# Altium project bms_mainboard-1_1.PrjPcb (part 6 of 8)

## Sheet eth_ksz8567r_switch.SchDoc
size C
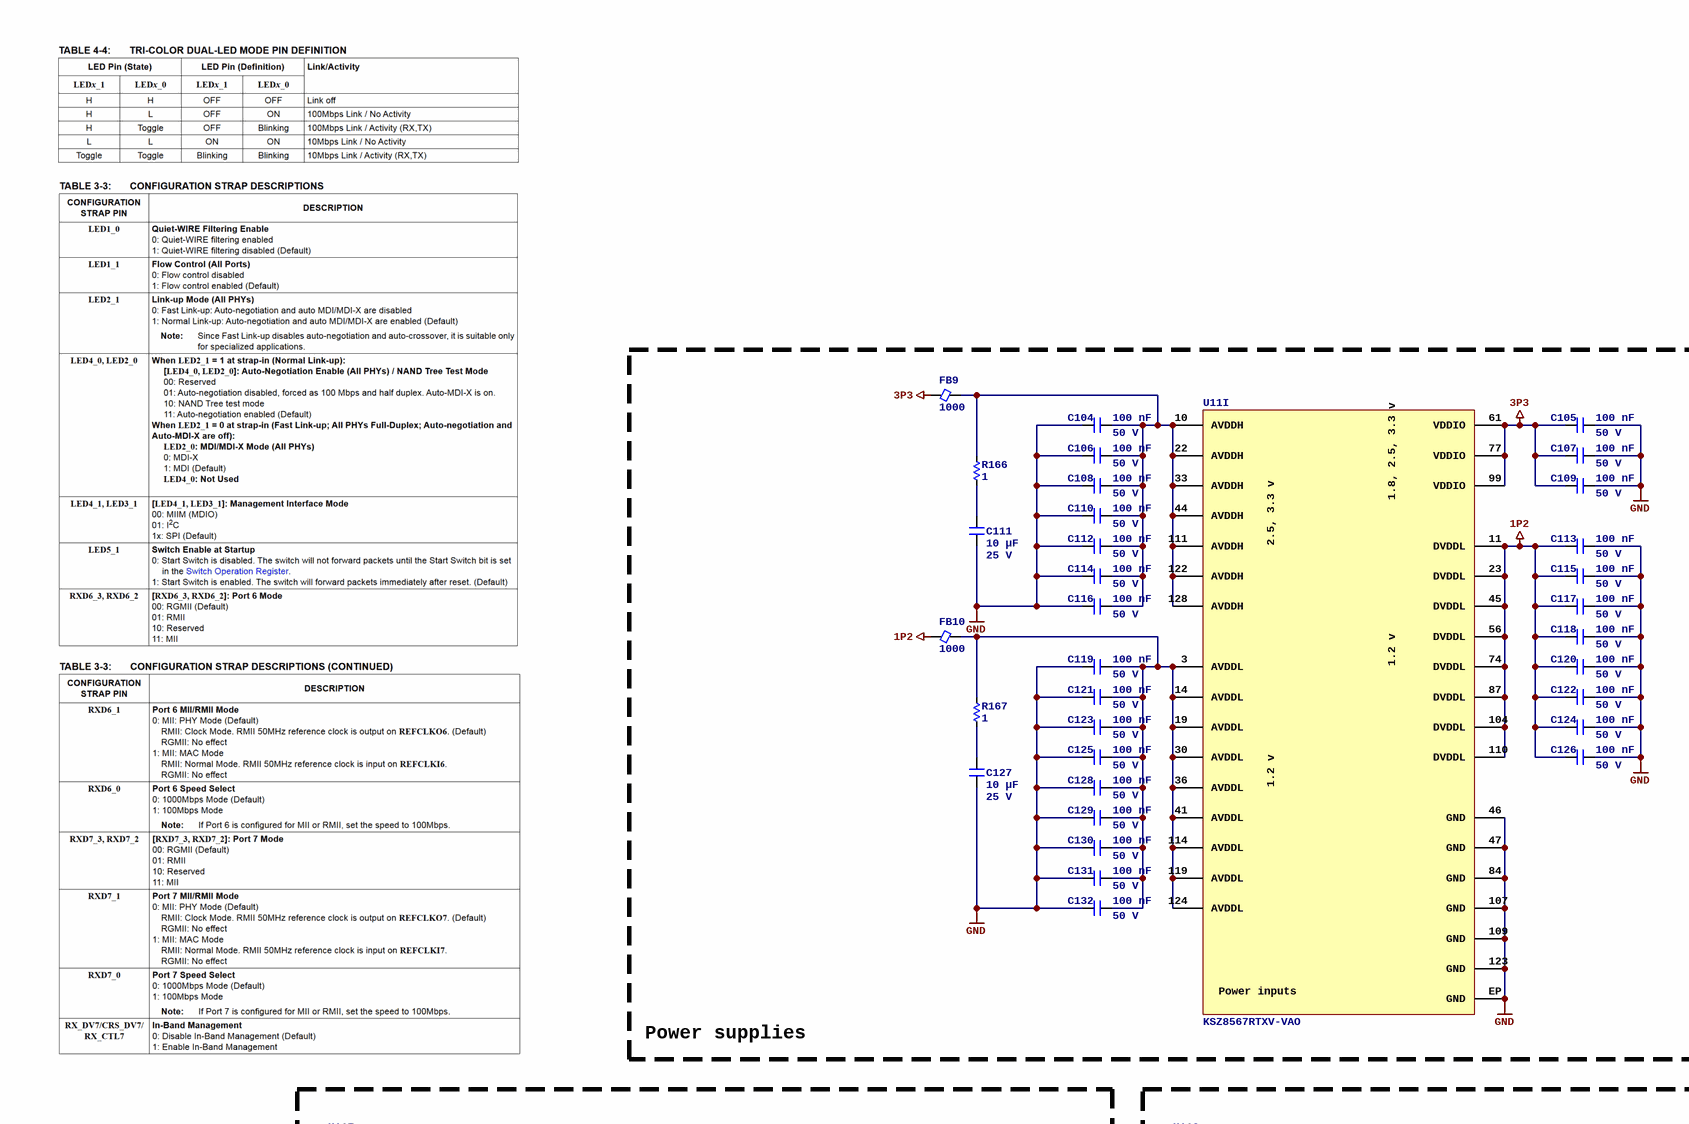
[diagram p31: eth_ksz8567r_switch.SchDoc, top left]
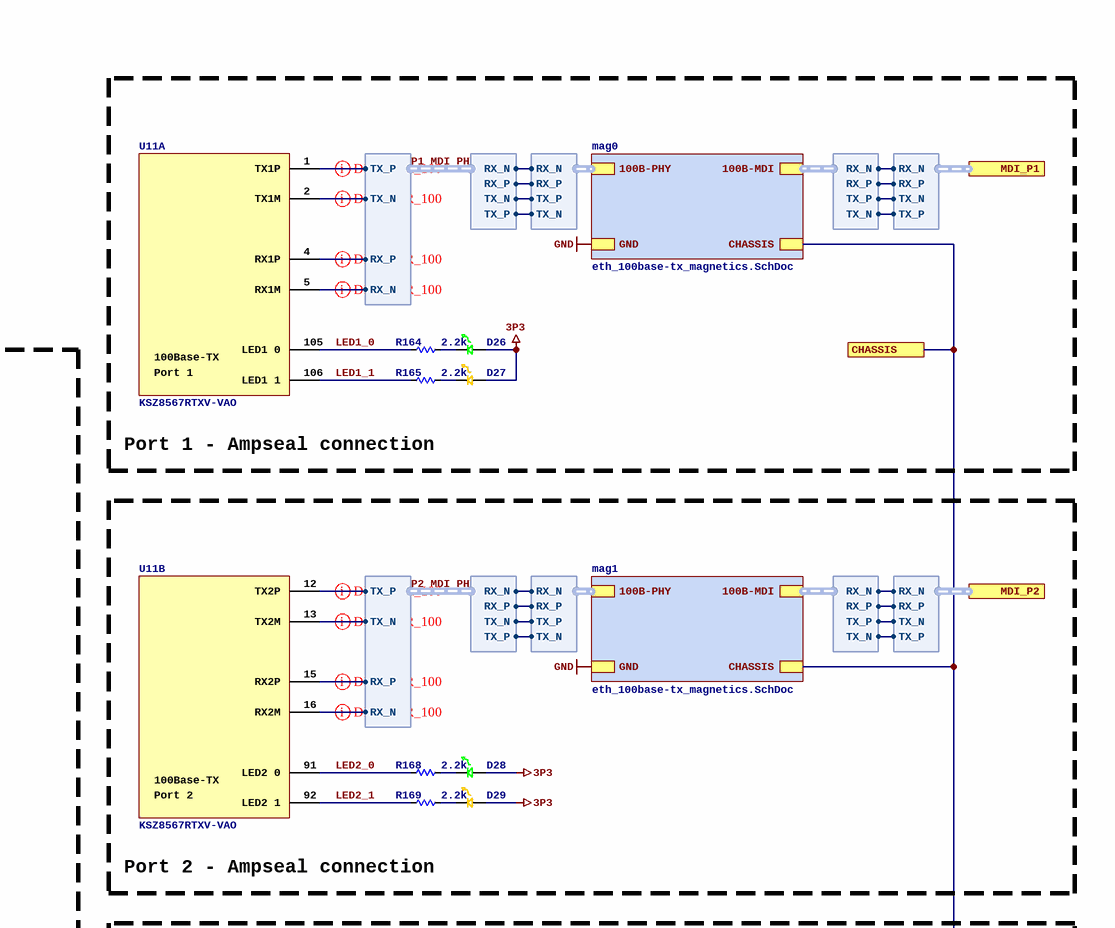
[diagram p32: eth_ksz8567r_switch.SchDoc, top right]
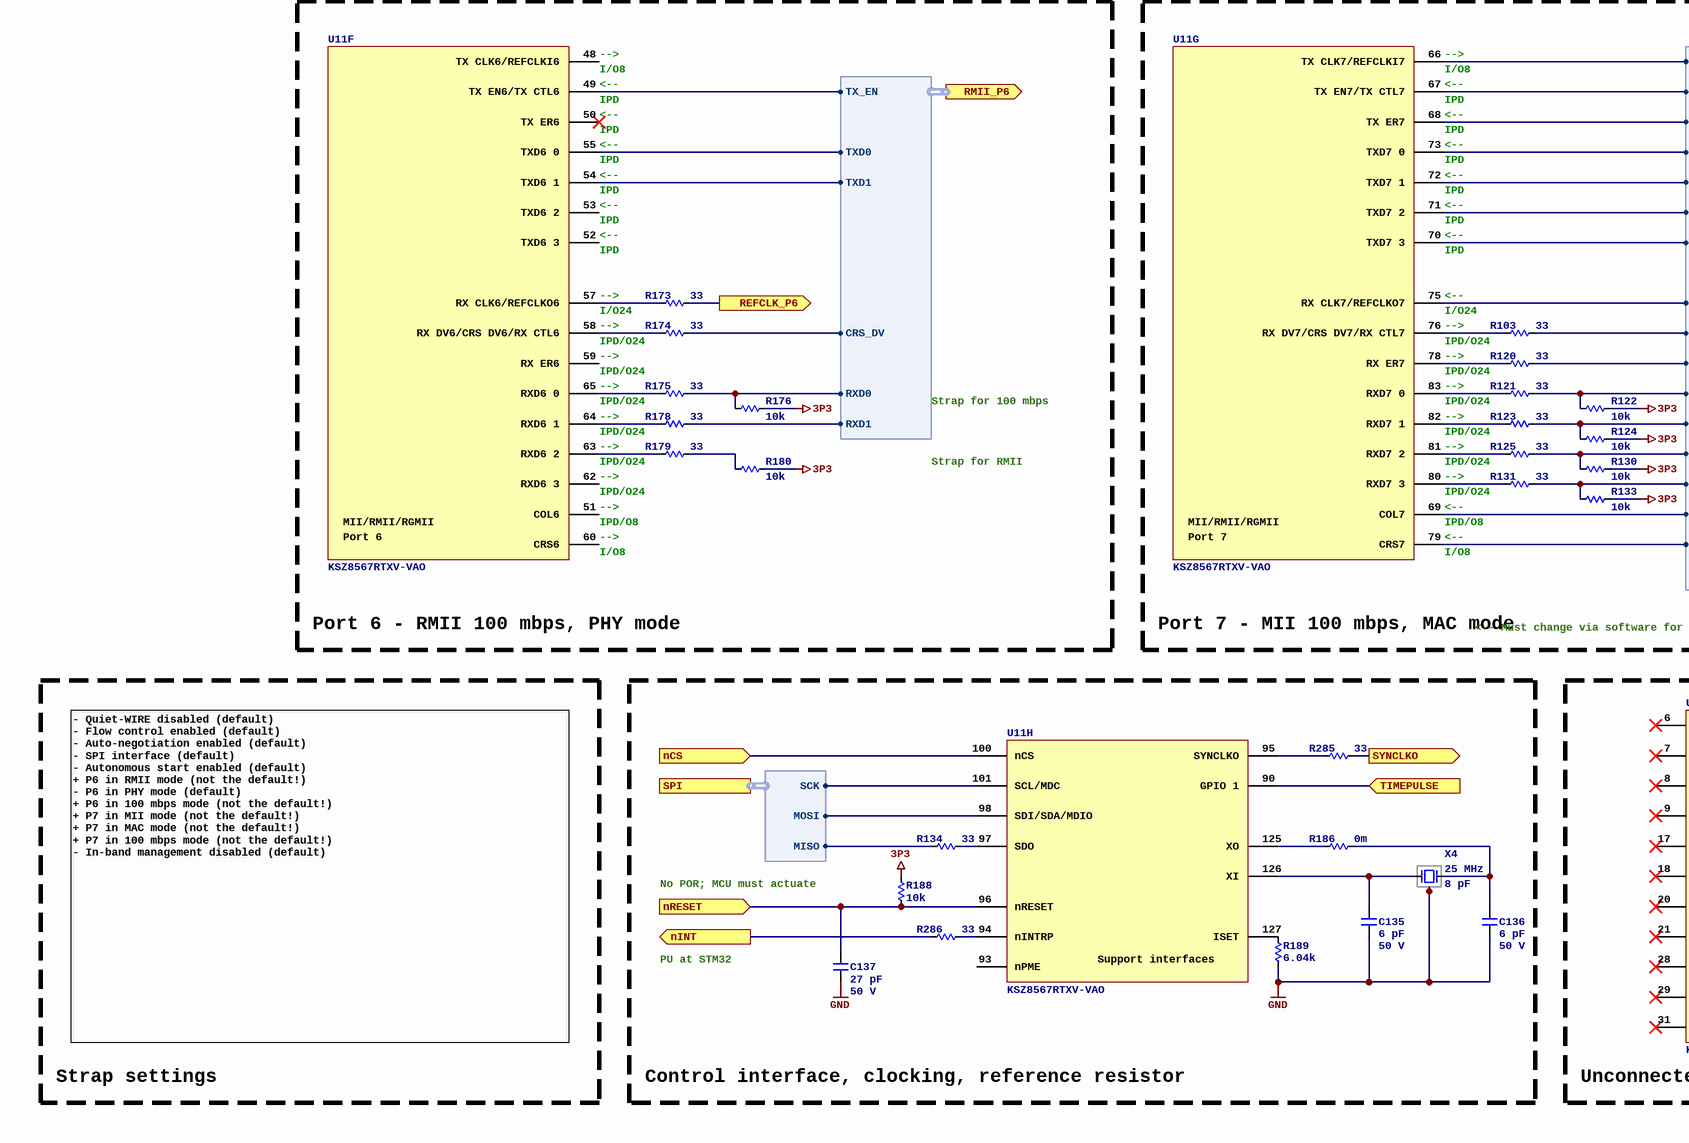
[diagram p33: eth_ksz8567r_switch.SchDoc, bottom left]
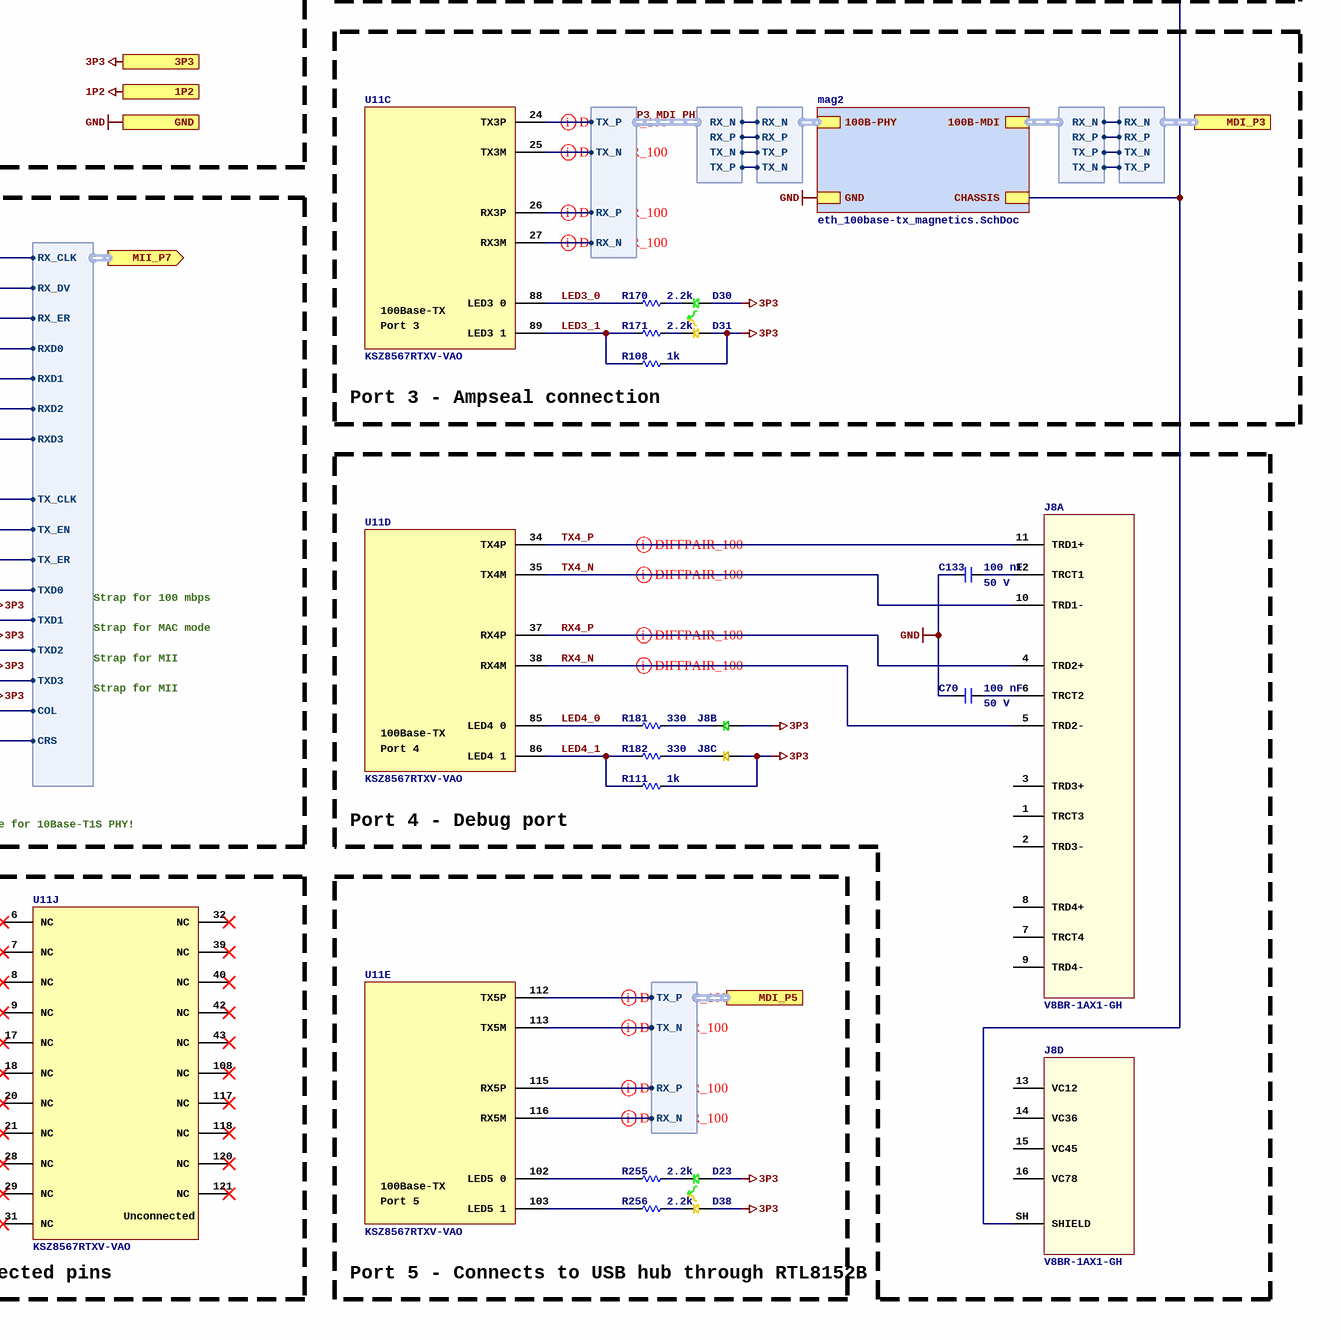
[diagram p34: eth_ksz8567r_switch.SchDoc, bottom right]

### Parts
C70  Capacitance: 100 nF  Voltage Rating: 50 V  [C0402]  (hidden comment: CL05B104KB54PNC)
C104  Capacitance: 100 nF  Voltage Rating: 50 V  [C0402]  (hidden comment: CL05B104KB54PNC)
C105  Capacitance: 100 nF  Voltage Rating: 50 V  [C0402]  (hidden comment: CL05B104KB54PNC)
C106  Capacitance: 100 nF  Voltage Rating: 50 V  [C0402]  (hidden comment: CL05B104KB54PNC)
C107  Capacitance: 100 nF  Voltage Rating: 50 V  [C0402]  (hidden comment: CL05B104KB54PNC)
C108  Capacitance: 100 nF  Voltage Rating: 50 V  [C0402]  (hidden comment: CL05B104KB54PNC)
C109  Capacitance: 100 nF  Voltage Rating: 50 V  [C0402]  (hidden comment: CL05B104KB54PNC)
C110  Capacitance: 100 nF  Voltage Rating: 50 V  [C0402]  (hidden comment: CL05B104KB54PNC)
C111  Capacitance: 10 µF  Voltage Rating: 25 V  [C0805]  (hidden comment: CL21B106KAYQNNE)
C112  Capacitance: 100 nF  Voltage Rating: 50 V  [C0402]  (hidden comment: CL05B104KB54PNC)
C113  Capacitance: 100 nF  Voltage Rating: 50 V  [C0402]  (hidden comment: CL05B104KB54PNC)
C114  Capacitance: 100 nF  Voltage Rating: 50 V  [C0402]  (hidden comment: CL05B104KB54PNC)
C115  Capacitance: 100 nF  Voltage Rating: 50 V  [C0402]  (hidden comment: CL05B104KB54PNC)
C116  Capacitance: 100 nF  Voltage Rating: 50 V  [C0402]  (hidden comment: CL05B104KB54PNC)
C117  Capacitance: 100 nF  Voltage Rating: 50 V  [C0402]  (hidden comment: CL05B104KB54PNC)
C118  Capacitance: 100 nF  Voltage Rating: 50 V  [C0402]  (hidden comment: CL05B104KB54PNC)
C119  Capacitance: 100 nF  Voltage Rating: 50 V  [C0402]  (hidden comment: CL05B104KB54PNC)
C120  Capacitance: 100 nF  Voltage Rating: 50 V  [C0402]  (hidden comment: CL05B104KB54PNC)
C121  Capacitance: 100 nF  Voltage Rating: 50 V  [C0402]  (hidden comment: CL05B104KB54PNC)
C122  Capacitance: 100 nF  Voltage Rating: 50 V  [C0402]  (hidden comment: CL05B104KB54PNC)
C123  Capacitance: 100 nF  Voltage Rating: 50 V  [C0402]  (hidden comment: CL05B104KB54PNC)
C124  Capacitance: 100 nF  Voltage Rating: 50 V  [C0402]  (hidden comment: CL05B104KB54PNC)
C125  Capacitance: 100 nF  Voltage Rating: 50 V  [C0402]  (hidden comment: CL05B104KB54PNC)
C126  Capacitance: 100 nF  Voltage Rating: 50 V  [C0402]  (hidden comment: CL05B104KB54PNC)
C127  Capacitance: 10 µF  Voltage Rating: 25 V  [C0805]  (hidden comment: CL21B106KAYQNNE)
C128  Capacitance: 100 nF  Voltage Rating: 50 V  [C0402]  (hidden comment: CL05B104KB54PNC)
C129  Capacitance: 100 nF  Voltage Rating: 50 V  [C0402]  (hidden comment: CL05B104KB54PNC)
C130  Capacitance: 100 nF  Voltage Rating: 50 V  [C0402]  (hidden comment: CL05B104KB54PNC)
C131  Capacitance: 100 nF  Voltage Rating: 50 V  [C0402]  (hidden comment: CL05B104KB54PNC)
C132  Capacitance: 100 nF  Voltage Rating: 50 V  [C0402]  (hidden comment: CL05B104KB54PNC)
C133  Capacitance: 100 nF  Voltage Rating: 50 V  [C0402]  (hidden comment: CL05B104KB54PNC)
C135  Capacitance: 6 pF  Voltage Rating: 50 V  [C0402]  (hidden comment: 0402CG6R0C500NT)
C136  Capacitance: 6 pF  Voltage Rating: 50 V  [C0402]  (hidden comment: 0402CG6R0C500NT)
C137  Capacitance: 27 pF  Voltage Rating: 50 V  [C0402]  (hidden comment: 0402CG270J500NT)
D23  LTST-C190GKT  [LED_0603P_GREEN]  (value not drawn)
D26  LTST-C190GKT  [LED_0603P_GREEN]  (value not drawn)
D27  LTST-C190AKT  [LED_0603P_AMBER]  (value not drawn)
D28  LTST-C190GKT  [LED_0603P_GREEN]  (value not drawn)
D29  LTST-C190AKT  [LED_0603P_AMBER]  (value not drawn)
D30  LTST-C190GKT  [LED_0603P_GREEN]  (value not drawn)
D31  LTST-C190AKT  [LED_0603P_AMBER]  (value not drawn)
D38  LTST-C190AKT  [LED_0603P_AMBER]  (value not drawn)
FB9  Current Rating (mA): 1000  [FB0805]  (hidden comment: MGGB2012M600HT-LF)
FB10  Current Rating (mA): 1000  [FB0805]  (hidden comment: MGGB2012M600HT-LF)
J8  V8BR-1AX1-GH  [BELFUSE_V8BR-1AX1-GH]  (parts A,B,C,D of 4)
R103  value 33  [R0402]  (hidden comment: 0402WGF330JTCE)
R108  value 1k  [R0402]  (hidden comment: 0402WGF1001TCE)
R111  value 1k  [R0402]  (hidden comment: 0402WGF1001TCE)
R120  value 33  [R0402]  (hidden comment: 0402WGF330JTCE)
R121  value 33  [R0402]  (hidden comment: 0402WGF330JTCE)
R122  value 10k  [R0402]  (hidden comment: 0402WGF1002TCE)
R123  value 33  [R0402]  (hidden comment: 0402WGF330JTCE)
R124  value 10k  [R0402]  (hidden comment: 0402WGF1002TCE)
R125  value 33  [R0402]  (hidden comment: 0402WGF330JTCE)
R130  value 10k  [R0402]  (hidden comment: 0402WGF1002TCE)
R131  value 33  [R0402]  (hidden comment: 0402WGF330JTCE)
R133  value 10k  [R0402]  (hidden comment: 0402WGF1002TCE)
R134  value 33  [R0402]  (hidden comment: 0402WGF330JTCE)
R164  value 2.2k  [R0402]  (hidden comment: 0402WGF2201TCE)
R165  value 2.2k  [R0402]  (hidden comment: 0402WGF2201TCE)
R166  value 1  [R0402]  (hidden comment: CRCW04021R00FKED)
R167  value 1  [R0402]  (hidden comment: CRCW04021R00FKED)
R168  value 2.2k  [R0402]  (hidden comment: 0402WGF2201TCE)
R169  value 2.2k  [R0402]  (hidden comment: 0402WGF2201TCE)
R170  value 2.2k  [R0402]  (hidden comment: 0402WGF2201TCE)
R171  value 2.2k  [R0402]  (hidden comment: 0402WGF2201TCE)
R173  value 33  [R0402]  (hidden comment: 0402WGF330JTCE)
R174  value 33  [R0402]  (hidden comment: 0402WGF330JTCE)
R175  value 33  [R0402]  (hidden comment: 0402WGF330JTCE)
R176  value 10k  [R0402]  (hidden comment: 0402WGF1002TCE)
R178  value 33  [R0402]  (hidden comment: 0402WGF330JTCE)
R179  value 33  [R0402]  (hidden comment: 0402WGF330JTCE)
R180  value 10k  [R0402]  (hidden comment: 0402WGF1002TCE)
R181  value 330  [R0402]  (hidden comment: 0402WGF3300TCE)
R182  value 330  [R0402]  (hidden comment: 0402WGF3300TCE)
R186  value 0m  [R0402]  (hidden comment: 0402WGF0000TCE)
R188  value 10k  [R0402]  (hidden comment: 0402WGF1002TCE)
R189  value 6.04k  [R0402]  (hidden comment: 0402WGF6041TCE)
R255  value 2.2k  [R0402]  (hidden comment: 0402WGF2201TCE)
R256  value 2.2k  [R0402]  (hidden comment: 0402WGF2201TCE)
R285  value 33  [R0402]  (hidden comment: 0402WGF330JTCE)
R286  value 33  [R0402]  (hidden comment: 0402WGF330JTCE)
U11  KSZ8567RTXV-VAO  [MICROCHIP_C04-418B_128TQFP_14X14_10X10EP]  (parts A,B,C,D,E,F,G,H,I,J of 10)
X4  Frequency: 25 MHz  Capacitance: 8 pF  [4_SMD_2.0X1.6MM]  (hidden comment: ABM11W-25.0000MHZ-8-D1X-T3)

### Blocks framed on the sheet
Port 1 - Ampseal connection: D26 D27 R164 R165 U11
Power supplies: C104-C132 FB9 FB10 R166 R167 U11
Port 2 - Ampseal connection: D28 D29 R168 R169 U11
Port 3 - Ampseal connection: D30 D31 R108 R170 R171 U11
Port 6 - RMII 100 mbps, PHY mode: R173-R176 R178-R180 U11
Port 7 - MII 100 mbps, MAC mode: R103 R120-R125 R130 R131 R133 U11
Port 4 - Debug port: C70 C133 J8 R111 R181 R182 U11
Control interface, clocking, reference resistor: C135-C137 R134 R186 R188 R189 R285 R286 U11 X4
Unconnected pins: U11
Port 5 - Connects to USB hub through RTL8152B: D23 D38 R255 R256 U11

### Sub-sheets
mag0 = eth_100base-tx_magnetics.SchDoc: 100B-PHY (harness 100BASE-TX), GND, CHASSIS, 100B-MDI (harness 100BASE-TX)
mag1 = eth_100base-tx_magnetics.SchDoc: 100B-PHY (harness 100BASE-TX), GND, CHASSIS, 100B-MDI (harness 100BASE-TX)
mag2 = eth_100base-tx_magnetics.SchDoc: 100B-PHY (harness 100BASE-TX), GND, CHASSIS, 100B-MDI (harness 100BASE-TX)

### Ports
1P2, 3P3, CHASSIS, GND, MDI_P1 (harness 100BASE-TX), MDI_P2 (harness 100BASE-TX), MDI_P3 (harness 100BASE-TX), MDI_P5 (harness 100BASE-TX), MII_P7 (out, harness MII), nCS (in), nINT (out), nRESET (in), REFCLK_P6 (out), RMII_P6 (out, harness RMII), SPI (harness SPI), SYNCLKO (out), TIMEPULSE (in)

### Harnesses
100BASE-TX: RX_N, RX_P, TX_N, TX_P
RMII: CRS_DV, RXD0, RXD1, TX_EN, TXD0, TXD1
MII: RXD0, RXD1, TX_EN, TXD0, TXD1, RXD2, RXD3, TXD2, TXD3, TX_ER, TX_CLK, CRS, COL, RX_ER, RX_DV, RX_CLK
SPI: MISO, MOSI, SCK
100BASE-TX: TX_N, RX_N, RX_P, TX_P
100BASE-TX: TX_P, RX_N, TX_N, RX_P
100BASE-TX: TX_N, RX_N, TX_P, RX_P
100BASE-TX: TX_N, TX_P, RX_N, RX_P
100BASE-TX: RX_N, RX_P, TX_P, TX_N

### Nets
1P2: C113.1 C115.1 C117.1 C118.1 C120.1 C122.1 C124.1 C126.1 FB10.1 U11.11(DVDDL) U11.23(DVDDL) U11.45(DVDDL) U11.56(DVDDL) U11.74(DVDDL) U11.87(DVDDL) U11.104(DVDDL) U11.110(DVDDL) ; port 1P2
3P3: C105.1 C107.1 C109.1 D23.1 D26.1 D27.1 D28.1 D29.1 D30.1 D31.1 D38.1 FB9.1 J8.18 J8.20 R108.1 R111.1 R122.1 R124.1 R130.1 R133.1 R176.1 R180.1 R188.1 U11.61(VDDIO) U11.77(VDDIO) U11.99(VDDIO) ; port 3P3
CHASSIS: J8.SH(SHIELD) ; port CHASSIS, sheet mag0/CHASSIS, sheet mag1/CHASSIS, sheet mag2/CHASSIS
GND: C70.2 C104.2 C105.2 C106.2 C107.2 C108.2 C109.2 C110.2 C111.2 C112.2 C113.2 C114.2 C115.2 C116.2 C117.2 C118.2 C119.2 C120.2 C121.2 C122.2 C123.2 C124.2 C125.2 C126.2 C127.2 C128.2 C129.2 C130.2 C131.2 C132.2 C133.2 C135.2 C136.2 C137.2 R189.2 U11.46(GND) U11.47(GND) U11.84(GND) U11.107(GND) U11.109(GND) U11.123(GND) U11.EP(GND) X4.2 X4.4 ; port GND, sheet mag0/GND, sheet mag1/GND, sheet mag2/GND
ETH_P1.RX_N: port MDI_P1.RX_N, sheet mag0/100B-MDI.RX_N
ETH_P1.RX_P: port MDI_P1.RX_P, sheet mag0/100B-MDI.RX_P
ETH_P1.TX_N: port MDI_P1.TX_N, sheet mag0/100B-MDI.TX_P
ETH_P1.TX_P: port MDI_P1.TX_P, sheet mag0/100B-MDI.TX_N
ETH_P2.RX_N: port MDI_P2.RX_N, sheet mag1/100B-MDI.RX_N
ETH_P2.RX_P: port MDI_P2.RX_P, sheet mag1/100B-MDI.RX_P
ETH_P2.TX_N: port MDI_P2.TX_N, sheet mag1/100B-MDI.TX_P
ETH_P2.TX_P: port MDI_P2.TX_P, sheet mag1/100B-MDI.TX_N
ETH_P3.RX_N: port MDI_P3.RX_N, sheet mag2/100B-MDI.RX_N
ETH_P3.RX_P: port MDI_P3.RX_P, sheet mag2/100B-MDI.RX_P
ETH_P3.TX_N: port MDI_P3.TX_N, sheet mag2/100B-MDI.TX_P
ETH_P3.TX_P: port MDI_P3.TX_P, sheet mag2/100B-MDI.TX_N
ETH_P5.RX_N: U11.116(RX5M) ; port MDI_P5.RX_N
ETH_P5.RX_P: U11.115(RX5P) ; port MDI_P5.RX_P
ETH_P5.TX_N: U11.113(TX5M) ; port MDI_P5.TX_N
ETH_P5.TX_P: U11.112(TX5P) ; port MDI_P5.TX_P
ETH_REFCLK: R173.1 ; port REFCLK_P6
ETH_SWITCH_nINT: R286.2 ; port nINT
ETH_SWITCH_nRST: C137.1 R188.2 U11.96(nRESET) ; port nRESET
ETH_SWITCH_nSS3: U11.100(nCS) ; port nCS
ETH_SWITCH_SYNCLKO: R285.1 ; port SYNCLKO
LED1_0: R164.2 U11.105(LED1_0)
LED1_1: R165.2 U11.106(LED1_1)
LED2_0: R168.2 U11.91(LED2_0)
LED2_1: R169.2 U11.92(LED2_1)
LED3_0: R170.2 U11.88(LED3_0)
LED3_1: R108.2 R171.2 U11.89(LED3_1)
LED4_0: R181.1 U11.85(LED4_0)
LED4_1: R111.2 R182.1 U11.86(LED4_1)
MCU_RMII.CRS_DV: R174.1 ; port RMII_P6.CRS_DV
MCU_RMII.RXD0: R175.1 R176.2 ; port RMII_P6.RXD0
MCU_RMII.RXD1: R178.1 ; port RMII_P6.RXD1
MCU_RMII.TX_EN: U11.49(TX_EN6/TX_CTL6) ; port RMII_P6.TX_EN
MCU_RMII.TXD0: U11.55(TXD6_0) ; port RMII_P6.TXD0
MCU_RMII.TXD1: U11.54(TXD6_1) ; port RMII_P6.TXD1
MII_P7.COL: U11.69(COL7) ; port MII_P7.COL
MII_P7.CRS: U11.79(CRS7) ; port MII_P7.CRS
MII_P7.RX_CLK: U11.66(TX_CLK7/REFCLKI7) ; port MII_P7.RX_CLK
MII_P7.RX_DV: U11.67(TX_EN7/TX_CTL7) ; port MII_P7.RX_DV
MII_P7.RX_ER: U11.68(TX_ER7) ; port MII_P7.RX_ER
MII_P7.RXD0: U11.73(TXD7_0) ; port MII_P7.RXD0
MII_P7.RXD1: U11.72(TXD7_1) ; port MII_P7.RXD1
MII_P7.RXD2: U11.71(TXD7_2) ; port MII_P7.RXD2
MII_P7.RXD3: U11.70(TXD7_3) ; port MII_P7.RXD3
MII_P7.TX_CLK: U11.75(RX_CLK7/REFCLKO7) ; port MII_P7.TX_CLK
MII_P7.TX_EN: R103.1 ; port MII_P7.TX_EN
MII_P7.TX_ER: R120.1 ; port MII_P7.TX_ER
MII_P7.TXD0: R121.1 R122.2 ; port MII_P7.TXD0
MII_P7.TXD1: R123.1 R124.2 ; port MII_P7.TXD1
MII_P7.TXD2: R125.1 R130.2 ; port MII_P7.TXD2
MII_P7.TXD3: R131.1 R133.2 ; port MII_P7.TXD3
P1_MDI_PHY.RX_N: U11.5(RX1M) ; harness 100BASE-TX.RX_N, sheet mag0/100B-PHY.RX_N
P1_MDI_PHY.RX_P: U11.4(RX1P) ; harness 100BASE-TX.RX_P, sheet mag0/100B-PHY.RX_P
P1_MDI_PHY.TX_N: U11.2(TX1M) ; harness 100BASE-TX.TX_N, sheet mag0/100B-PHY.TX_P
P1_MDI_PHY.TX_P: U11.1(TX1P) ; harness 100BASE-TX.TX_P, sheet mag0/100B-PHY.TX_N
P2_MDI_PHY.RX_N: U11.16(RX2M) ; harness 100BASE-TX.RX_N, sheet mag1/100B-PHY.RX_N
P2_MDI_PHY.RX_P: U11.15(RX2P) ; harness 100BASE-TX.RX_P, sheet mag1/100B-PHY.RX_P
P2_MDI_PHY.TX_N: U11.13(TX2M) ; harness 100BASE-TX.TX_N, sheet mag1/100B-PHY.TX_P
P2_MDI_PHY.TX_P: U11.12(TX2P) ; harness 100BASE-TX.TX_P, sheet mag1/100B-PHY.TX_N
P3_MDI_PHY.RX_N: U11.27(RX3M) ; harness 100BASE-TX.RX_N, sheet mag2/100B-PHY.RX_N
P3_MDI_PHY.RX_P: U11.26(RX3P) ; harness 100BASE-TX.RX_P, sheet mag2/100B-PHY.RX_P
P3_MDI_PHY.TX_N: U11.25(TX3M) ; harness 100BASE-TX.TX_N, sheet mag2/100B-PHY.TX_P
P3_MDI_PHY.TX_P: U11.24(TX3P) ; harness 100BASE-TX.TX_P, sheet mag2/100B-PHY.TX_N
RX4_N: J8.5(TRD2-) U11.38(RX4M)
RX4_P: J8.4(TRD2+) U11.37(RX4P)
SPI2.MISO: R134.2 ; port SPI.MISO
SPI2.MOSI: U11.98(SDI/SDA/MDIO) ; port SPI.MOSI
SPI2.SCK: U11.101(SCL/MDC) ; port SPI.SCK
TIMEPULSE: U11.90(GPIO_1) ; port TIMEPULSE
TX4_N: J8.10(TRD1-) U11.35(TX4M)
TX4_P: J8.11(TRD1+) U11.34(TX4P)
NetC70_1: C70.1 J8.6(TRCT2)
NetC104_1: C104.1 C106.1 C108.1 C110.1 C112.1 C114.1 C116.1 FB9.2 R166.2 U11.10(AVDDH) U11.22(AVDDH) U11.33(AVDDH) U11.44(AVDDH) U11.111(AVDDH) U11.122(AVDDH) U11.128(AVDDH)
NetC111_1: C111.1 R166.1
NetC119_1: C119.1 C121.1 C123.1 C125.1 C128.1 C129.1 C130.1 C131.1 C132.1 FB10.2 R167.2 U11.3(AVDDL) U11.14(AVDDL) U11.19(AVDDL) U11.30(AVDDL) U11.36(AVDDL) U11.41(AVDDL) U11.114(AVDDL) U11.119(AVDDL) U11.124(AVDDL)
NetC127_1: C127.1 R167.1
NetC133_1: C133.1 J8.12(TRCT1)
NetC135_1: C135.1 U11.126(XI) X4.1
NetC136_1: C136.1 R186.2 X4.3
NetD23_2: D23.2 R255.1
NetD26_2: D26.2 R164.1
NetD27_2: D27.2 R165.1
NetD28_2: D28.2 R168.1
NetD29_2: D29.2 R169.1
NetD30_2: D30.2 R170.1
NetD31_2: D31.2 R171.1
NetD38_2: D38.2 R256.1
NetJ8_17: J8.17 R182.2
NetJ8_19: J8.19 R181.2
NetR103_2: R103.2 U11.76(RX_DV7/CRS_DV7/RX_CTL7)
NetR120_2: R120.2 U11.78(RX_ER7)
NetR121_2: R121.2 U11.83(RXD7_0)
NetR123_2: R123.2 U11.82(RXD7_1)
NetR125_2: R125.2 U11.81(RXD7_2)
NetR131_2: R131.2 U11.80(RXD7_3)
NetR134_1: R134.1 U11.97(SDO)
NetR173_2: R173.2 U11.57(RX_CLK6/REFCLKO6)
NetR174_2: R174.2 U11.58(RX_DV6/CRS_DV6/RX_CTL6)
NetR175_2: R175.2 U11.65(RXD6_0)
NetR178_2: R178.2 U11.64(RXD6_1)
NetR179_1: R179.1 R180.2
NetR179_2: R179.2 U11.63(RXD6_2)
NetR186_1: R186.1 U11.125(XO)
NetR189_1: R189.1 U11.127(ISET)
NetR255_2: R255.2 U11.102(LED5_0)
NetR256_2: R256.2 U11.103(LED5_1)
NetR285_2: R285.2 U11.95(SYNCLKO)
NetR286_1: R286.1 U11.94(nINTRP)

Not connected (* = marked no-connect by the designer): J8 1(TRCT3) 2(TRD3-) 3(TRD3+) 7(TRCT4) 8(TRD4+) 9(TRD4-) 13(VC12) 14(VC36) 15(VC45) 16(VC78); U11 6(NC)* 7(NC)* 8(NC)* 9(NC)* 17(NC)* 18(NC)* 20(NC)* 21(NC)* 28(NC)* 29(NC)* 31(NC)* 32(NC)* 39(NC)* 40(NC)* 42(NC)* 43(NC)* 48(TX_CLK6/REFCLKI6) 50(TX_ER6)* 51(COL6) 52(TXD6_3) 53(TXD6_2) 59(RX_ER6) 60(CRS6) 62(RXD6_3) 93(nPME) 108(NC)* 117(NC)* 118(NC)* 120(NC)* 121(NC)*

### Layout directives
differential pair; differential pair class DE_100: ETH_P5.RX_N, ETH_P5.RX_P, ETH_P5.TX_N, ETH_P5.TX_P, P1_MDI_PHY.RX_N, P1_MDI_PHY.RX_P, P1_MDI_PHY.TX_N, P1_MDI_PHY.TX_P, P2_MDI_PHY.RX_N, P2_MDI_PHY.RX_P, P2_MDI_PHY.TX_N, P2_MDI_PHY.TX_P, P3_MDI_PHY.RX_N, P3_MDI_PHY.RX_P, P3_MDI_PHY.TX_N, P3_MDI_PHY.TX_P, RX4_N, RX4_P, TX4_N, TX4_P

### Notes on the sheet
- (near U11) -->
- (near U11) I/O8
- (near U11) <--
- (near U11) IPD
- I/O24
- IPD/O24
- Strap for 100 mbps
- Strap for MAC mode
- (near U11) IPD/O8
- Strap for RMII
- IPD/O8
- Strap for MII
- <-- Must change via software for 10Base-T1S PHY!
- No POR; MCU must actuate
- PU at STM32
- - Quiet-WIRE disabled (default)
  - Flow control enabled (default)
  - Auto-negotiation enabled (default)
  - SPI interface (default)
  - Autonomous start enabled (default)
  + P6 in RMII mode (not the default!)
  - P6 in PHY mode (default)
  + P6 in 100 mbps mode (not the default!)
  + P7 in MII mode (not the default!)
  + P7 in MAC mode (not the default!)
  + P7 in 100 mbps mode (not the default!)
  - In-band management disabled (default)
- Strap settings
- (in symbol KSZ8567RTXV-VAO, part A) 100Base-TX; Port 1
- (in symbol KSZ8567RTXV-VAO, part B) 100Base-TX; Port 2
- (in symbol KSZ8567RTXV-VAO, part C) 100Base-TX; Port 3
- (in symbol KSZ8567RTXV-VAO, part D) 100Base-TX; Port 4
- (in symbol KSZ8567RTXV-VAO, part E) 100Base-TX; Port 5
- (in symbol KSZ8567RTXV-VAO, part F) MII/RMII/RGMII; Port 6
- (in symbol KSZ8567RTXV-VAO, part G) MII/RMII/RGMII; Port 7
- (in symbol KSZ8567RTXV-VAO, part H) Support interfaces
- (in symbol KSZ8567RTXV-VAO, part I) 1.8, 2.5, 3.3 v; 2.5, 3.3 v; 1.2 v; Power inputs
- (in symbol KSZ8567RTXV-VAO, part J) Unconnected

### Library data of the parts
C70 C104-C110 C112-C126 C128-C133 = CL05B104KB54PNC: Manufacturer: Samsung Electro-Mechanics; Dielectric: X7R; ComponentLink1URL: https://wmsc.lcsc.com/wmsc/upload/file/pdf/v2/lcsc/2304140030_Samsung-Electro-Mechanics-CL05B104KB54PNC_C307331.pdf; ComponentLink1Description: Datasheet; Manufacturer Part Number: CL05B104KB54PNC; Package: 0402; Supplier 2: LCSC; Supplier Part Number 2: C307331
C111 C127 = CL21B106KAYQNNE: Manufacturer: Samsung Electro-Mechanics; Dielectric: X7R; ComponentLink1URL: https://datasheet.lcsc.com/lcsc/2206222030_Samsung-Electro-Mechanics-CL21B106KAYQNNE_C3039694.pdf; ComponentLink1Description: Datasheet; Manufacturer Part Number: CL21B106KAYQNNE; Package: 0805; Supplier 2: LCSC; Supplier Part Number 2: C3039694
C135 C136 = 0402CG6R0C500NT: Manufacturer: FH(Guangdong Fenghua Advanced Tech); Dielectric: C0G; ComponentLink1URL: https://wmsc.lcsc.com/wmsc/upload/file/pdf/v2/lcsc/2304140030_FH--Guangdong-Fenghua-Advanced-Tech-0402CG6R0C500NT_C1575.pdf; ComponentLink1Description: Datasheet; Manufacturer Part Number: 0402CG6R0C500NT; Package: 0402; Supplier 2: LCSC; Supplier Part Number 2: C1575
C137 = 0402CG270J500NT: Manufacturer: FH(Guangdong Fenghua Advanced Tech); Dielectric: C0G; ComponentLink1URL: https://wmsc.lcsc.com/wmsc/upload/file/pdf/v2/lcsc/2304140030_FH--Guangdong-Fenghua-Advanced-Tech-0402CG270J500NT_C1557.pdf; ComponentLink1Description: Datasheet; Manufacturer Part Number: 0402CG270J500NT; Package: 0402; Supplier 2: LCSC; Supplier Part Number 2: C1557
D23 D26 D28 D30 = LTST-C190GKT: LED GREEN CLEAR 0603 SMD; Manufacturer: Lite-On Inc; Vf: 2.0 V; If: 20 mA; Supplier 1: DigiKey; ComponentLink1URL: https://mm.digikey.com/Volume0/opasdata/d220001/medias/docus/858/LTST-C190GKT.pdf; ComponentLink1Description: Datasheet; Supplier Part Number 1: 160-1183-1-ND; Manufacturer Part Number: LTST-C190GKT; Supplier 2: LCSC; Supplier Part Number 2: C125093; LED Color: Green; Supplier 3: Mouser; Supplier Part Number 3: 859-LTST-C190GKT
D27 D29 D31 D38 = LTST-C190AKT: LED AMBER CLEAR 0603 SMD; Manufacturer: Lite-On Inc; Vf: 2.1 V; If: 20 mA; Supplier 1: DigiKey; ComponentLink1URL: https://mm.digikey.com/Volume0/opasdata/d220001/medias/docus/1139/LTST-C190AKT.pdf; ComponentLink1Description: Datasheet; Supplier Part Number 1: 160-1180-1-ND; Manufacturer Part Number: LTST-C190AKT; Supplier 2: LCSC; Supplier Part Number 2: C6085129; LED Color: Amber; Supplier 3: Mouser; Supplier Part Number 3: 859-LTST-C190AKT
FB9 FB10 = MGGB2012M600HT-LF: Manufacturer: microgate; Z @ 100 MHz: 60; DCR (mOhms): 50; ComponentLink1URL: https://wmsc.lcsc.com/wmsc/upload/file/pdf/v2/lcsc/2304140030_microgate-MGGB2012M600HT-LF_C281169.pdf; ComponentLink1Description: Datasheet; Manufacturer Part Number: MGGB2012M600HT-LF; Supplier 2: LCSC; Supplier Part Number 2: C281169; Package: 0805
J8 = V8BR-1AX1-GH: Conn RJ-45 F 8 POS 1.02mm Solder ST Thru-Hole 20 Terminal 1 Port Tray; Manufacturer: Bel; Supplier 1: DigiKey; Supplier Part Number 1: 5923-V8BR-1AX1-GH-ND; Manufacturer Part Number: V8BR-1AX1-GH; ComponentLink1URL: https://www.belfuse.com/media/drawings/products/magjack%20ICMs/dr-MAG-V8BR-1AX1-GH.pdf; ComponentLink1Description: Drawing; Supplier 2: LCSC; Supplier Part Number 2: C5346729; Supplier 3: Mouser; Supplier Part Number 3: 530-V8BR-1AX1-GH
R103 R120 R121 R123 R125 R131 R134 R173-R175 R178 R179 R285 R286 = 0402WGF330JTCE: Manufacturer: UNI-ROYAL(Uniroyal Elec); Tolerance: 1%; Temperature Coefficient: ±100ppm/?; Power Rating (mW): 62.5; ComponentLink1Description: Datasheet; ComponentLink1URL: https://wmsc.lcsc.com/wmsc/upload/file/pdf/v2/lcsc/2205311900_UNI-ROYAL-Uniroyal-Elec-0402WGF330JTCE_C25105.pdf; Manufacturer Part Number: 0402WGF330JTCE; Package: 0402; Supplier 2: LCSC; Supplier Part Number 2: C25105
R108 R111 = 0402WGF1001TCE: Manufacturer: UNI-ROYAL(Uniroyal Elec); Tolerance: 1%; Temperature Coefficient: ±100ppm/?; Power Rating (mW): 62.5; ComponentLink1Description: Datasheet; ComponentLink1URL: https://wmsc.lcsc.com/wmsc/upload/file/pdf/v2/lcsc/2206010216_UNI-ROYAL-Uniroyal-Elec-0402WGF1001TCE_C11702.pdf; Manufacturer Part Number: 0402WGF1001TCE; Package: 0402; Supplier 2: LCSC; Supplier Part Number 2: C11702
R122 R124 R130 R133 R176 R180 R188 = 0402WGF1002TCE: Manufacturer: UNI-ROYAL(Uniroyal Elec); Tolerance: 1%; Temperature Coefficient: ±100ppm/?; Power Rating (mW): 62.5; ComponentLink1Description: Datasheet; ComponentLink1URL: https://wmsc.lcsc.com/wmsc/upload/file/pdf/v2/lcsc/2206010100_UNI-ROYAL-Uniroyal-Elec-0402WGF1002TCE_C25744.pdf; Manufacturer Part Number: 0402WGF1002TCE; Package: 0402; Supplier 2: LCSC; Supplier Part Number 2: C25744
R164 R165 R168-R171 R255 R256 = 0402WGF2201TCE: Manufacturer: UNI-ROYAL(Uniroyal Elec); Tolerance: 1%; Temperature Coefficient: ±100ppm/?; Power Rating (mW): 62.5; ComponentLink1Description: Datasheet; ComponentLink1URL: https://wmsc.lcsc.com/wmsc/upload/file/pdf/v2/lcsc/2206010045_UNI-ROYAL-Uniroyal-Elec-0402WGF2201TCE_C25879.pdf; Manufacturer Part Number: 0402WGF2201TCE; Package: 0402; Supplier 2: LCSC; Supplier Part Number 2: C25879
R166 R167 = CRCW04021R00FKED: Manufacturer: Vishay Intertech; Tolerance: 1%; Temperature Coefficient: ±100ppm/?; Power Rating (mW): 63; ComponentLink1Description: Datasheet; ComponentLink1URL: https://wmsc.lcsc.com/wmsc/upload/file/pdf/v2/lcsc/2211030200_Vishay-Intertech-CRCW04021R00FKED_C482087.pdf; Manufacturer Part Number: CRCW04021R00FKED; Package: 0402; Supplier 2: LCSC; Supplier Part Number 2: C482087
R181 R182 = 0402WGF3300TCE: Manufacturer: UNI-ROYAL(Uniroyal Elec); Tolerance: 1%; Temperature Coefficient: ±100ppm/?; Power Rating (mW): 62.5; ComponentLink1Description: Datasheet; ComponentLink1URL: https://wmsc.lcsc.com/wmsc/upload/file/pdf/v2/lcsc/2205311900_UNI-ROYAL-Uniroyal-Elec-0402WGF3300TCE_C25104.pdf; Manufacturer Part Number: 0402WGF3300TCE; Package: 0402; Supplier 2: LCSC; Supplier Part Number 2: C25104
R186 = 0402WGF0000TCE: Manufacturer: UNI-ROYAL(Uniroyal Elec); Power Rating (mW): 62.5; ComponentLink1Description: Datasheet; ComponentLink1URL: https://wmsc.lcsc.com/wmsc/upload/file/pdf/v2/lcsc/2206010216_UNI-ROYAL-Uniroyal-Elec-0402WGF0000TCE_C17168.pdf; Manufacturer Part Number: 0402WGF0000TCE; Package: 0402; Supplier 2: LCSC; Supplier Part Number 2: C17168
R189 = 0402WGF6041TCE: Manufacturer: UNI-ROYAL(Uniroyal Elec); Tolerance: 1%; Temperature Coefficient: ±100ppm/?; Power Rating (mW): 62.5; ComponentLink1Description: Datasheet; ComponentLink1URL: https://wmsc.lcsc.com/wmsc/upload/file/pdf/v2/lcsc/2206010045_UNI-ROYAL-Uniroyal-Elec-0402WGF6041TCE_C25913.pdf; Manufacturer Part Number: 0402WGF6041TCE; Package: 0402; Supplier 2: LCSC; Supplier Part Number 2: C25913
U11 = KSZ8567RTXV-VAO: Automotive Ethernet Switch 7 Port 10Mbps/100Mbps 128-Pin TQFP EP Tray; Manufacturer: Microchip; Manufacturer Part Number: KSZ8567RTXV-VAO; ComponentLink1Description: Datasheet; ComponentLink1URL: https://ww1.microchip.com/downloads/aemDocuments/documents/UNG/ProductDocuments/DataSheets/KSZ8567R-Data-Sheet-DS00002328.pdf; Supplier 3: microchipDIRECT; Supplier Part Number 3: KSZ8567RTXV-VAO
X4 = ABM11W-25.0000MHZ-8-D1X-T3: 25 MHz ±10ppm Crystal 8pF 50 Ohms 4-SMD, No Lead; Manufacturer: Abracon LLC; Supplier 1: DigiKey; Supplier Part Number 1: 535-13853-1-ND; Manufacturer Part Number: ABM11W-25.0000MHZ-8-D1X-T3; ComponentLink1Description: Datasheet; ComponentLink1URL: https://abracon.com/Resonators/ABM11W.pdf; Supplier 2: LCSC; Supplier Part Number 2: C1985767; Supplier 3: Mouser; Supplier Part Number 3: 815-11W25-8D1XT

## Sheet eth_100base-tx_magnetics.SchDoc
size A
Used 3 times, as channels conn_harness_lv/ethernet_switch/mag0, conn_harness_lv/ethernet_switch/mag1, conn_harness_lv/ethernet_switch/mag2. Parts and nets are listed once, with the designators drawn on the sheet.
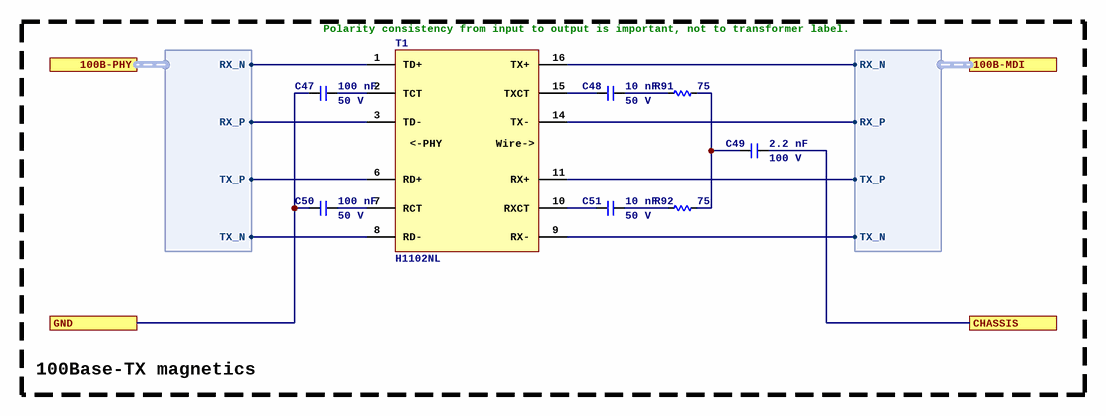
[diagram p35: eth_100base-tx_magnetics.SchDoc]

### Parts
C47  Capacitance: 100 nF  Voltage Rating: 50 V  [C0402]  (hidden comment: CL05B104KB54PNC)
C48  Capacitance: 10 nF  Voltage Rating: 50 V  [C0402]  (hidden comment: CL05B103KB5NNNC)
C49  Capacitance: 2.2 nF  Voltage Rating: 100 V  [C0402]  (hidden comment: CC0402KRX7R0BB222)
C50  Capacitance: 100 nF  Voltage Rating: 50 V  [C0402]  (hidden comment: CL05B104KB54PNC)
C51  Capacitance: 10 nF  Voltage Rating: 50 V  [C0402]  (hidden comment: CL05B103KB5NNNC)
R91  value 75  [R0402]  (hidden comment: 0402WGF750JTCE)
R92  value 75  [R0402]  (hidden comment: 0402WGF750JTCE)
T1  H1102NL  [EPCOS_LAN_MODULE]

### Blocks framed on the sheet
100Base-TX magnetics: C47-C51 R91 R92 T1

### Ports
100B-MDI (harness 100BASE-TX), 100B-PHY (harness 100BASE-TX), CHASSIS, GND

### Harnesses
100BASE-TX: RX_N, RX_P, TX_N, TX_P
100BASE-TX: TX_N, TX_P, RX_N, RX_P

### Nets
CHASSIS: C49.2 ; port CHASSIS
GND: C47.2 C50.2 ; port GND
NetC47_1: C47.1 T1.2(TCT)
NetC48_1: C48.1 T1.15(TXCT)
NetC48_2: C48.2 R91.2
NetC49_1: C49.1 R91.1 R92.1
NetC50_1: C50.1 T1.7(RCT)
NetC51_1: C51.1 T1.10(RXCT)
NetC51_2: C51.2 R92.2
NetT1_1: T1.1(TD+) ; port 100B-PHY.RX_N
NetT1_3: T1.3(TD-) ; port 100B-PHY.RX_P
NetT1_6: T1.6(RD+) ; port 100B-PHY.TX_P
NetT1_8: T1.8(RD-) ; port 100B-PHY.TX_N
NetT1_9: T1.9(RX-) ; port 100B-MDI.TX_N
NetT1_11: T1.11(RX+) ; port 100B-MDI.TX_P
NetT1_14: T1.14(TX-) ; port 100B-MDI.RX_P
NetT1_16: T1.16(TX+) ; port 100B-MDI.RX_N

### Channels
conn_harness_lv/ethernet_switch/mag0: designators end in A; ports CHASSIS=CHASSIS GND=GND
conn_harness_lv/ethernet_switch/mag1: designators end in B; ports CHASSIS=CHASSIS GND=GND
conn_harness_lv/ethernet_switch/mag2: designators end in C; ports CHASSIS=CHASSIS GND=GND

### Notes on the sheet
- (near T1) Polarity consistency from input to output is important, not to transformer label.
- (in symbol H1102NL) <-PHY; Wire->

### Library data of the parts
C47 C50 = CL05B104KB54PNC: as C70 on sheet eth_ksz8567r_switch; ComponentLink1URL: https://wmsc.lcsc.com/wmsc/upload/file/pdf/v2/lcsc/2304140030_Samsung-Electro-Mechanics-CL05B104KB54PNC_C307331.pdf; ComponentLink1Description: Datasheet; Manufacturer Part Number: CL05B104KB54PNC; Package: 0402; Supplier 2: LCSC; Supplier Part Number 2: C307331
C48 C51 = CL05B103KB5NNNC: Manufacturer: Samsung Electro-Mechanics; Dielectric: X7R; ComponentLink1URL: https://wmsc.lcsc.com/wmsc/upload/file/pdf/v2/lcsc/2304140030_Samsung-Electro-Mechanics-CL05B103KB5NNNC_C15195.pdf; ComponentLink1Description: Datasheet; Manufacturer Part Number: CL05B103KB5NNNC; Package: 0402; Supplier 2: LCSC; Supplier Part Number 2: C15195
C49 = CC0402KRX7R0BB222: Manufacturer: YAGEO; Dielectric: X7R; ComponentLink1URL: https://wmsc.lcsc.com/wmsc/upload/file/pdf/v2/lcsc/2211211800_YAGEO-CC0402KRX7R0BB222_C576731.pdf; ComponentLink1Description: Datasheet; Manufacturer Part Number: CC0402KRX7R0BB222; Package: 0402; Supplier 2: LCSC; Supplier Part Number 2: C576731
R91 R92 = 0402WGF750JTCE: Manufacturer: UNI-ROYAL(Uniroyal Elec); Tolerance: 1%; Temperature Coefficient: ±100ppm/?; Power Rating (mW): 62.5; ComponentLink1Description: Datasheet; ComponentLink1URL: https://wmsc.lcsc.com/wmsc/upload/file/pdf/v2/lcsc/2205311900_UNI-ROYAL-Uniroyal-Elec-0402WGF750JTCE_C25133.pdf; Manufacturer Part Number: 0402WGF750JTCE; Package: 0402; Supplier 2: LCSC; Supplier Part Number 2: C25133
T1 = H1102NL: MODULE XFRMR SGL ETHR LAN 16SOIC; Manufacturer: Pulse Electronics Corporation; Supplier 1: DigiKey; ComponentLink1URL: https://productfinder.pulseelectronics.com/api/open/part-attachments/datasheet/H1102NL; ComponentLink1Description: Datasheet; Supplier Part Number 1: 553-1323-ND; Manufacturer Part Number: H1102NL; Supplier 2: LCSC; Supplier Part Number 2: C18584; Supplier 3: Mouser; Supplier Part Number 3: 673-H1102NL

## Sheet switch_vn9e30f.SchDoc
size A
Used 3 times, as channels conn_harness_lv/lv_switch0, conn_harness_lv/lv_switch1, conn_harness_lv/lv_switch2. Parts and nets are listed once, with the designators drawn on the sheet.
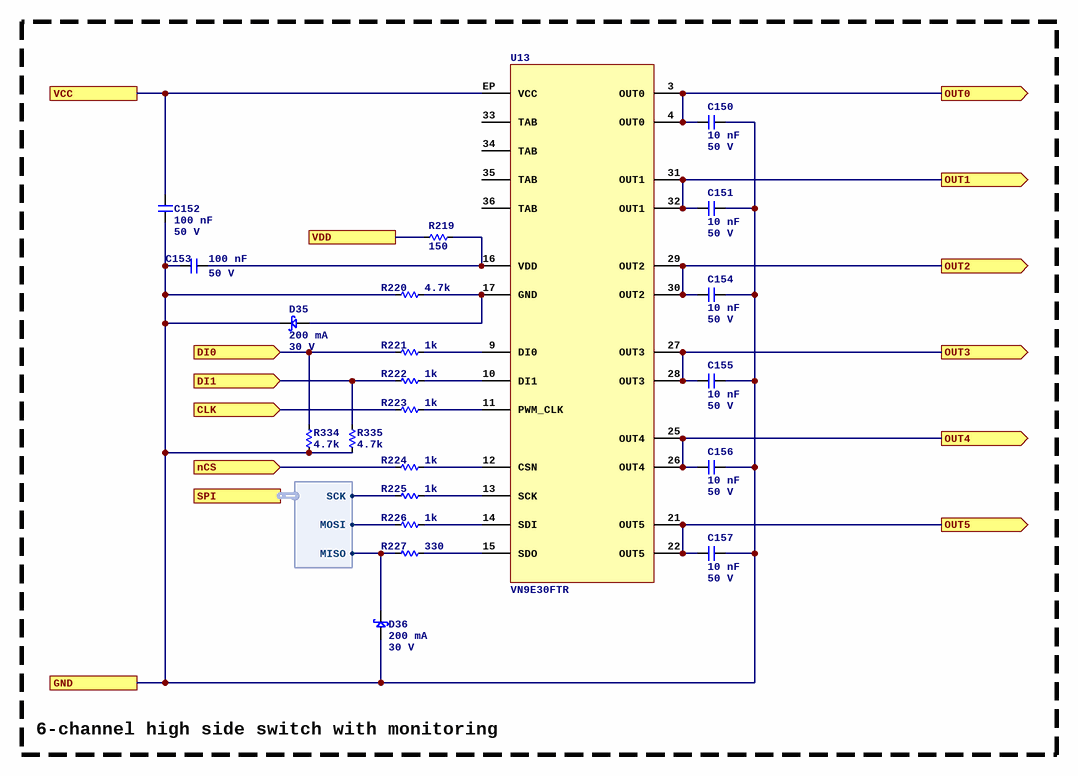
[diagram p36: switch_vn9e30f.SchDoc]

### Parts
C150  Capacitance: 10 nF  Voltage Rating: 50 V  [C0402]  (hidden comment: CL05B103KB5NNNC)
C151  Capacitance: 10 nF  Voltage Rating: 50 V  [C0402]  (hidden comment: CL05B103KB5NNNC)
C152  Capacitance: 100 nF  Voltage Rating: 50 V  [C0402]  (hidden comment: CL05B104KB54PNC)
C153  Capacitance: 100 nF  Voltage Rating: 50 V  [C0402]  (hidden comment: CL05B104KB54PNC)
C154  Capacitance: 10 nF  Voltage Rating: 50 V  [C0402]  (hidden comment: CL05B103KB5NNNC)
C155  Capacitance: 10 nF  Voltage Rating: 50 V  [C0402]  (hidden comment: CL05B103KB5NNNC)
C156  Capacitance: 10 nF  Voltage Rating: 50 V  [C0402]  (hidden comment: CL05B103KB5NNNC)
C157  Capacitance: 10 nF  Voltage Rating: 50 V  [C0402]  (hidden comment: CL05B103KB5NNNC)
D35  Current: 200 mA  Vr: 30 V  [SOD523]  (hidden comment: BAT54XV2T1G)
D36  Current: 200 mA  Vr: 30 V  [SOD523]  (hidden comment: BAT54XV2T1G)
R219  value 150  [R0402]  (hidden comment: 0402WGF1500TCE)
R220  value 4.7k  [R0402]  (hidden comment: 0402WGF4701TCE)
R221  value 1k  [R0402]  (hidden comment: 0402WGF1001TCE)
R222  value 1k  [R0402]  (hidden comment: 0402WGF1001TCE)
R223  value 1k  [R0402]  (hidden comment: 0402WGF1001TCE)
R224  value 1k  [R0402]  (hidden comment: 0402WGF1001TCE)
R225  value 1k  [R0402]  (hidden comment: 0402WGF1001TCE)
R226  value 1k  [R0402]  (hidden comment: 0402WGF1001TCE)
R227  value 330  [R0402]  (hidden comment: 0402WGF3300TCE)
R334  value 4.7k  [R0402]  (hidden comment: 0402WGF4701TCE)
R335  value 4.7k  [R0402]  (hidden comment: 0402WGF4701TCE)
U13  VN9E30FTR  [ST_ECOPACK_QFN50P600X600X90-32N]

### Blocks framed on the sheet
6-channel high side switch with monitoring: C150-C157 D35 D36 R219-R227 R334 R335 U13

### Ports
CLK (in), DI0 (in), DI1 (in), GND, nCS (in), OUT0 (out), OUT1 (out), OUT2 (out), OUT3 (out), OUT4 (out), OUT5 (out), SPI (harness SPI), VCC, VDD

### Harnesses
SPI: MISO, MOSI, SCK

### Nets
CLK: R223.2 ; port CLK
DI0: R221.2 R334.1 ; port DI0
DI1: R222.2 R335.1 ; port DI1
GND: C150.2 C151.2 C152.2 C153.2 C154.2 C155.2 C156.2 C157.2 D35.2 D36.1 R220.2 R334.2 R335.2 ; port GND
nCS: R224.2 ; port nCS
OUT0: C150.1 U13.3(OUT0) U13.4(OUT0) ; port OUT0
OUT1: C151.1 U13.31(OUT1) U13.32(OUT1) ; port OUT1
OUT2: C154.1 U13.29(OUT2) U13.30(OUT2) ; port OUT2
OUT3: C155.1 U13.27(OUT3) U13.28(OUT3) ; port OUT3
OUT4: C156.1 U13.25(OUT4) U13.26(OUT4) ; port OUT4
OUT5: C157.1 U13.21(OUT5) U13.22(OUT5) ; port OUT5
VCC: C152.1 U13.EP(VCC) ; port VCC
VDD: R219.1 ; port VDD
NetC153_1: C153.1 R219.2 U13.16(VDD)
NetD35_1: D35.1 R220.1 U13.17(GND)
NetD36_2: D36.2 R227.1 ; port SPI.MISO
NetR221_1: R221.1 U13.9(DI0)
NetR222_1: R222.1 U13.10(DI1)
NetR223_1: R223.1 U13.11(PWM_CLK)
NetR224_1: R224.1 U13.12(CSN)
NetR225_1: R225.1 U13.13(SCK)
NetR225_2: R225.2 ; port SPI.SCK
NetR226_1: R226.1 U13.14(SDI)
NetR226_2: R226.2 ; port SPI.MOSI
NetR227_2: R227.2 U13.15(SDO)

Not connected (* = marked no-connect by the designer): U13 33(TAB) 34(TAB) 35(TAB) 36(TAB)

### Channels
conn_harness_lv/lv_switch0: designators end in A; ports CLK=LV_PWM_CLK DI0=SW0_DI0 DI1=SW0_DI1 GND=GND nCS=LV_nSS0 OUT0=NetC150A_1 OUT1=NetC151A_1 OUT2=NetC154A_1 OUT3=NetC155A_1 OUT4=NetC156A_1 OUT5=NetC157A_1 VCC=SYS VDD=3P3
conn_harness_lv/lv_switch1: designators end in B; ports CLK=LV_PWM_CLK DI0=SW1_DI0 DI1=SW1_DI1 GND=GND nCS=LV_nSS1 OUT0=NetC150B_1 OUT1=NetC151B_1 OUT2=NetC154B_1 OUT3=NetC155B_1 OUT4=LV2 OUT5=LV1 VCC=SYS VDD=3P3
conn_harness_lv/lv_switch2: designators end in C; ports CLK=LV_PWM_CLK DI0=SW2_DI0 DI1=SW2_DI1 GND=GND nCS=LV_nSS2 OUT0=NetC150C_1 OUT1=NetC151C_1 OUT2=NetC154C_1 OUT3=NetC155C_1 OUT4=NetC156C_1 OUT5=NetC157C_1 VCC=SYS VDD=3P3

### Library data of the parts
C150 C151 C154-C157 = CL05B103KB5NNNC: as C48 on sheet eth_100base-tx_magnetics; ComponentLink1URL: https://wmsc.lcsc.com/wmsc/upload/file/pdf/v2/lcsc/2304140030_Samsung-Electro-Mechanics-CL05B103KB5NNNC_C15195.pdf; ComponentLink1Description: Datasheet; Manufacturer Part Number: CL05B103KB5NNNC; Package: 0402; Supplier 2: LCSC; Supplier Part Number 2: C15195
C152 C153 = CL05B104KB54PNC: as C70 on sheet eth_ksz8567r_switch; ComponentLink1URL: https://wmsc.lcsc.com/wmsc/upload/file/pdf/v2/lcsc/2304140030_Samsung-Electro-Mechanics-CL05B104KB54PNC_C307331.pdf; ComponentLink1Description: Datasheet; Manufacturer Part Number: CL05B104KB54PNC; Package: 0402; Supplier 2: LCSC; Supplier Part Number 2: C307331
D35 D36 = BAT54XV2T1G: ON Semi BAT54XV2T1G; SMT Schottky Diode; 30V 200mA; 5ns; 2-Pin SOD-523; Manufacturer: onsemi; Supplier 1: DigiKey; Supplier Part Number 1: BAT54XV2T1GOSCT-ND; Manufacturer Part Number: BAT54XV2T1G; Supplier 2: LCSC; Supplier Part Number 2: C81572; ComponentLink1Description: Datasheet; ComponentLink1URL: https://www.onsemi.com/pdf/datasheet/bat54xv2t1-d.pdf; Diode Type: Schottky; Supplier 3: Mouser; Supplier Part Number 3: 863-BAT54XV2T1G
R219 = 0402WGF1500TCE: Manufacturer: UNI-ROYAL(Uniroyal Elec); Tolerance: 1%; Temperature Coefficient: ±100ppm/?; Power Rating (mW): 62.5; ComponentLink1Description: Datasheet; ComponentLink1URL: https://wmsc.lcsc.com/wmsc/upload/file/pdf/v2/lcsc/2205311900_UNI-ROYAL-Uniroyal-Elec-0402WGF1500TCE_C25082.pdf; Manufacturer Part Number: 0402WGF1500TCE; Package: 0402; Supplier 2: LCSC; Supplier Part Number 2: C25082
R220 R334 R335 = 0402WGF4701TCE: Manufacturer: UNI-ROYAL(Uniroyal Elec); Tolerance: 1%; Temperature Coefficient: ±100ppm/?; Power Rating (mW): 62.5; ComponentLink1Description: Datasheet; ComponentLink1URL: https://wmsc.lcsc.com/wmsc/upload/file/pdf/v2/lcsc/2206010045_UNI-ROYAL-Uniroyal-Elec-0402WGF4701TCE_C25900.pdf; Manufacturer Part Number: 0402WGF4701TCE; Package: 0402; Supplier 2: LCSC; Supplier Part Number 2: C25900
R221-R226 = 0402WGF1001TCE: as R108 on sheet eth_ksz8567r_switch; ComponentLink1Description: Datasheet; ComponentLink1URL: https://wmsc.lcsc.com/wmsc/upload/file/pdf/v2/lcsc/2206010216_UNI-ROYAL-Uniroyal-Elec-0402WGF1001TCE_C11702.pdf; Manufacturer Part Number: 0402WGF1001TCE; Package: 0402; Supplier 2: LCSC; Supplier Part Number 2: C11702
R227 = 0402WGF3300TCE: as R181 on sheet eth_ksz8567r_switch; ComponentLink1Description: Datasheet; ComponentLink1URL: https://wmsc.lcsc.com/wmsc/upload/file/pdf/v2/lcsc/2205311900_UNI-ROYAL-Uniroyal-Elec-0402WGF3300TCE_C25104.pdf; Manufacturer Part Number: 0402WGF3300TCE; Package: 0402; Supplier 2: LCSC; Supplier Part Number 2: C25104
U13 = VN9E30FTR: Power Switch/Driver 1:6 N-Channel 35A 32-QFN (6x6); Manufacturer: STMicroelectronics; Supplier 1: DigiKey; Supplier Part Number 1: 497-VN9E30FTRCT-ND; Manufacturer Part Number: VN9E30FTR; ComponentLink1Description: Datasheet; ComponentLink1URL: https://www.st.com/resource/en/datasheet/vn9e30f.pdf; Supplier 2: LCSC; Supplier Part Number 2: C29447350; Supplier 3: Mouser; Supplier Part Number 3: 511-VN9E30FTR

## Sheet analog_sensor_input.SchDoc
size A
Used 2 times, as channels conn_harness_lv/sensor0, conn_harness_lv/sensor1. Parts and nets are listed once, with the designators drawn on the sheet.
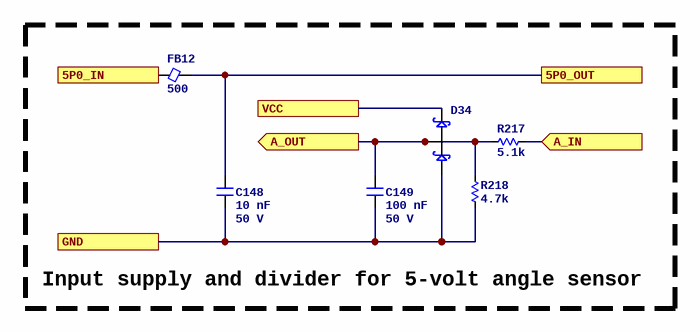
[diagram p37: analog_sensor_input.SchDoc]

### Parts
C148  Capacitance: 10 nF  Voltage Rating: 50 V  [C0402]  (hidden comment: CL05B103KB5NNNC)
C149  Capacitance: 100 nF  Voltage Rating: 50 V  [C0402]  (hidden comment: CL05B104KB54PNC)
D34  BAT54SLT1G  [3SOT23]  (value not drawn)
FB12  Current Rating (mA): 500  [FB0402]  (hidden comment: BLM15AX601SN1D)
R217  value 5.1k  [R0402]  (hidden comment: 0402WGF5101TCE)
R218  value 4.7k  [R0402]  (hidden comment: 0402WGF4701TCE)

### Blocks framed on the sheet
Input supply and divider for 5-volt angle sensor: C148 C149 D34 FB12 R217 R218

### Ports
5P0_IN, 5P0_OUT, A_IN (in), A_OUT (out), GND, VCC

### Nets
5P0_IN: FB12.1 ; port 5P0_IN
5P0_OUT: C148.1 FB12.2 ; port 5P0_OUT
A_IN: R217.2 ; port A_IN
A_OUT: C149.1 D34.3 R217.1 R218.2 ; port A_OUT
GND: C148.2 C149.2 D34.1 R218.1 ; port GND
VCC: D34.2 ; port VCC

### Channels
conn_harness_lv/sensor0: designators end in A; ports 5P0_IN=5P0 5P0_OUT=NetC148A_1 A_IN=NetJ12_2 A_OUT=AIN0 GND=GND VCC=3P3
conn_harness_lv/sensor1: designators end in B; ports 5P0_IN=5P0 5P0_OUT=NetC148B_1 A_IN=NetJ12_5 A_OUT=AIN1 GND=GND VCC=3P3

### Library data of the parts
C148 = CL05B103KB5NNNC: as C48 on sheet eth_100base-tx_magnetics; ComponentLink1URL: https://wmsc.lcsc.com/wmsc/upload/file/pdf/v2/lcsc/2304140030_Samsung-Electro-Mechanics-CL05B103KB5NNNC_C15195.pdf; ComponentLink1Description: Datasheet; Manufacturer Part Number: CL05B103KB5NNNC; Package: 0402; Supplier 2: LCSC; Supplier Part Number 2: C15195
C149 = CL05B104KB54PNC: as C70 on sheet eth_ksz8567r_switch; ComponentLink1URL: https://wmsc.lcsc.com/wmsc/upload/file/pdf/v2/lcsc/2304140030_Samsung-Electro-Mechanics-CL05B104KB54PNC_C307331.pdf; ComponentLink1Description: Datasheet; Manufacturer Part Number: CL05B104KB54PNC; Package: 0402; Supplier 2: LCSC; Supplier Part Number 2: C307331
D34 = BAT54SLT1G: DIODE SCHOTTKY DUAL 30V SOT23; Manufacturer: ON Semiconductor; Current: 200 mA; Supplier 1: DigiKey; Manufacturer Part Number: BAT54SLT1G; ComponentLink1URL: https://www.onsemi.com/pdf/datasheet/bat54slt1-d.pdf; ComponentLink1Description: Datasheet; Supplier Part Number 1: BAT54SLT1GOSCT-ND; Supplier 2: LCSC; Supplier Part Number 2: C19726; Diode Type: Schottky; Vr: 30 V; Supplier 3: Mouser; Supplier Part Number 3: 863-BAT54SLT1G
FB12 = BLM15AX601SN1D: Manufacturer: Murata Electronics; Z @ 100 MHz: 600; DCR (mOhms): 340; ComponentLink1URL: https://wmsc.lcsc.com/wmsc/upload/file/pdf/v2/lcsc/2304140030_Murata-Electronics-BLM15AX601SN1D_C76886.pdf; ComponentLink1Description: Datasheet; Manufacturer Part Number: BLM15AX601SN1D; Supplier 2: LCSC; Supplier Part Number 2: C76886; Package: 0402
R217 = 0402WGF5101TCE: Manufacturer: UNI-ROYAL(Uniroyal Elec); Tolerance: 1%; Temperature Coefficient: ±100ppm/?; Power Rating (mW): 62.5; ComponentLink1Description: Datasheet; ComponentLink1URL: https://wmsc.lcsc.com/wmsc/upload/file/pdf/v2/lcsc/2206010045_UNI-ROYAL-Uniroyal-Elec-0402WGF5101TCE_C25905.pdf; Manufacturer Part Number: 0402WGF5101TCE; Package: 0402; Supplier 2: LCSC; Supplier Part Number 2: C25905
R218 = 0402WGF4701TCE: as R220 on sheet switch_vn9e30f; ComponentLink1Description: Datasheet; ComponentLink1URL: https://wmsc.lcsc.com/wmsc/upload/file/pdf/v2/lcsc/2206010045_UNI-ROYAL-Uniroyal-Elec-0402WGF4701TCE_C25900.pdf; Manufacturer Part Number: 0402WGF4701TCE; Package: 0402; Supplier 2: LCSC; Supplier Part Number 2: C25900

## Sheet digital_input_protection.SchDoc
size A
Used 4 times, as channels conn_harness_lv/digital0, conn_harness_lv/digital1, conn_harness_lv/digital2, conn_harness_lv/digital3. Parts and nets are listed once, with the designators drawn on the sheet.
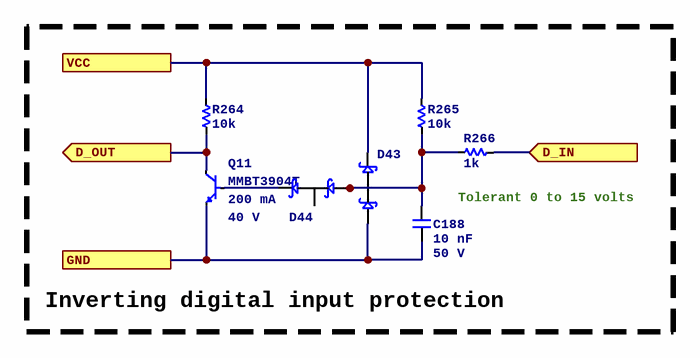
[diagram p38: digital_input_protection.SchDoc]

### Parts
C188  Capacitance: 10 nF  Voltage Rating: 50 V  [C0402]  (hidden comment: CL05B103KB5NNNC)
D43  BAT54SLT1G  [3SOT23]  (value not drawn)
D44  BAT54SLT1G  [3SOT23]  (value not drawn)
Q11  MMBT3904T  Current: 200 mA  Voltage: 40 V  [3SOT523]
R264  value 10k  [R0402]  (hidden comment: 0402WGF1002TCE)
R265  value 10k  [R0402]  (hidden comment: 0402WGF1002TCE)
R266  value 1k  [R0805]  (hidden comment: HP05W3F1001T5E)

### Ports
D_IN (in), D_OUT (out), GND, VCC

### Nets
D_IN: R266.1 ; port D_IN
D_OUT: Q11.3(C) R264.1 ; port D_OUT
GND: C188.2 D43.1 Q11.2(E) ; port GND
VCC: D43.2 R264.2 R265.2 ; port VCC
NetC188_1: C188.1 D43.3 D44.1 R265.1 R266.2
NetD44_2: D44.2 Q11.1(B)

Not connected (* = marked no-connect by the designer): D44 3

### Channels
conn_harness_lv/digital0: designators end in A; ports D_IN=NetJ12_19 D_OUT=DIN0 GND=GND VCC=3P3
conn_harness_lv/digital1: designators end in B; ports D_IN=NetJ12_9 D_OUT=DIN1 GND=GND VCC=3P3
conn_harness_lv/digital2: designators end in C; ports D_IN=NetJ13_13 D_OUT=DIN2 GND=GND VCC=3P3
conn_harness_lv/digital3: designators end in D; ports D_IN=NetJ13_15 D_OUT=DIN3 GND=GND VCC=3P3

### Notes on the sheet
- Tolerant 0 to 15 volts
- Inverting digital input protection

### Library data of the parts
C188 = CL05B103KB5NNNC: as C48 on sheet eth_100base-tx_magnetics; ComponentLink1URL: https://wmsc.lcsc.com/wmsc/upload/file/pdf/v2/lcsc/2304140030_Samsung-Electro-Mechanics-CL05B103KB5NNNC_C15195.pdf; ComponentLink1Description: Datasheet; Manufacturer Part Number: CL05B103KB5NNNC; Package: 0402; Supplier 2: LCSC; Supplier Part Number 2: C15195
D43 D44 = BAT54SLT1G: as D34 on sheet analog_sensor_input; Supplier 1: DigiKey; Manufacturer Part Number: BAT54SLT1G; ComponentLink1URL: https://www.onsemi.com/pdf/datasheet/bat54slt1-d.pdf; ComponentLink1Description: Datasheet; Supplier Part Number 1: BAT54SLT1GOSCT-ND; Supplier 2: LCSC; Supplier Part Number 2: C19726; Diode Type: Schottky; Vr: 30 V; Supplier 3: Mouser; Supplier Part Number 3: 863-BAT54SLT1G
Q11 = MMBT3904T: Bipolar (BJT) Transistor NPN 40 V 200 mA 300MHz 150 mW Surface Mount SOT-523; Manufacturer: Shenzhen Slkormicro Semicon Co., Ltd.; Supplier 1: DigiKey; Supplier Part Number 1: 5399-MMBT3904TCT-ND; Manufacturer Part Number: MMBT3904T; ComponentLink1Description: Datasheet; ComponentLink1URL: https://mm.digikey.com/Volume0/opasdata/d220001/medias/docus/7136/5399_MMBT3904T%20SOT-523.pdf; Supplier 2: LCSC; Supplier Part Number 2: C61616; Polarity: NPN
R264 R265 = 0402WGF1002TCE: as R122 on sheet eth_ksz8567r_switch; ComponentLink1Description: Datasheet; ComponentLink1URL: https://wmsc.lcsc.com/wmsc/upload/file/pdf/v2/lcsc/2206010100_UNI-ROYAL-Uniroyal-Elec-0402WGF1002TCE_C25744.pdf; Manufacturer Part Number: 0402WGF1002TCE; Package: 0402; Supplier 2: LCSC; Supplier Part Number 2: C25744
R266 = HP05W3F1001T5E: Manufacturer: UNI-ROYAL(Uniroyal Elec); Tolerance: 1%; Temperature Coefficient: ±100ppm/?; Power Rating (mW): 333.3; ComponentLink1Description: Datasheet; ComponentLink1URL: https://datasheet.lcsc.com/lcsc/2304140030_UNI-ROYAL-Uniroyal-Elec-HP05W3F1001T5E_C2759346.pdf; Manufacturer Part Number: HP05W3F1001T5E; Package: 0805; Supplier 2: LCSC; Supplier Part Number 2: C2759346